# Altium schematic sheet MotorDriver.SchDoc
size A4
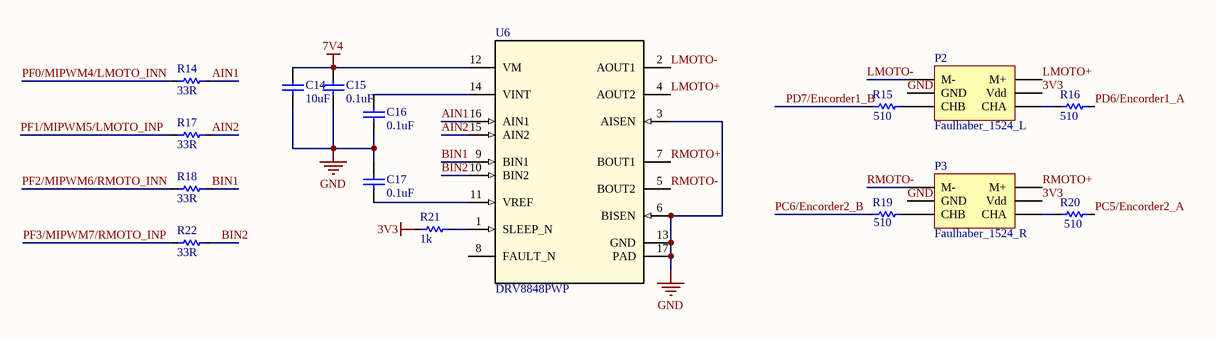
[diagram p0: MotorDriver.SchDoc]

## Parts
C14  value 10uF  [1206]  (hidden comment: 1uF/0603/50V)
C15  value 0.1uF  [0603C]  (hidden comment: 1uF/0603/50V)
C16  value 0.1uF  [0603C]  (hidden comment: 1uF/0603/50V)
C17  value 0.1uF  [0603C]  (hidden comment: 1uF/0603/50V)
P2  Faulhaber_1524_L  [HDR2X3_2.0Mm]
P3  Faulhaber_1524_R  [HDR2X3_2.0Mm]
R14  33R  [0603R]
R15  value 510  [0603R]  (hidden comment: 1K/5%)
R16  510  [0603R]
R17  33R  [0603R]
R18  33R  [0603R]
R19  value 510  [0603R]  (hidden comment: 1K/5%)
R20  value 510  [0603R]  (hidden comment: 1K/5%)
R21  1k  [0603R]
R22  33R  [0603R]
U6  DRV8848PWP  [HSSOP_N]

## Nets
3V3: P2.4(Vdd) P3.4(Vdd) R21.1
7V4: C14.1 C15.1 U6.12(VM)
GND: C14.2 C15.2 C16.2 C17.2 P2.3(GND) P3.3(GND) U6.3(AISEN) U6.6(BISEN) U6.13(GND) U6.17(PAD)
AIN1: R14.2 U6.16(AIN1)
AIN2: R17.2 U6.15(AIN2)
BIN1: R18.2 U6.9(BIN1)
BIN2: R22.2 U6.10(BIN2)
LMOTO+: P2.2(M+) U6.4(AOUT2)
LMOTO-: P2.1(M-) U6.2(AOUT1)
PC5/Encorder2_A: R20.2
PC6/Encorder2_B: R19.1
PD6/Encorder1_A: R16.2
PD7/Encorder1_B: R15.1
PF0/MIPWM4/LMOTO_INN: R14.1
PF1/MIPWM5/LMOTO_INP: R17.1
PF2/MIPWM6/RMOTO_INN: R18.1
PF3/MIPWM7/RMOTO_INP: R22.1
RMOTO+: P3.2(M+) U6.7(BOUT1)
RMOTO-: P3.1(M-) U6.5(BOUT2)
NetC16_1: C16.1 U6.14(VINT)
NetC17_1: C17.1 U6.11(VREF)
NetP2_5: P2.5(CHB) R15.2
NetP2_6: P2.6(CHA) R16.1
NetP3_5: P3.5(CHB) R19.2
NetP3_6: P3.6(CHA) R20.1
NetR21_2: R21.2 U6.1(SLEEP_N)

Not connected (* = marked no-connect by the designer): U6 8(FAULT_N)

## Library data of the parts
C14-C17 = Cap: Capacitor; Published: 8-Jun-2000; LatestRevisionDate: 17-Jul-2002; LatestRevisionNote: Re-released for DXP Platform.; PackageReference: RAD-0.3; Publisher: Altium Limited; PackageDescription: Radial Cap, Thru-Hole; 2 Leads; 0.3 in Pin Spacing
P2 P3 = Faulhaber_1524
R14 R16-R18 R22 = Res1: Resistor; Value: 1K; Published: 8-Jun-2000; LatestRevisionDate: 17-Jul-2002; LatestRevisionNote: Re-released for DXP Platform.; PackageReference: AXIAL-0.3; Publisher: Altium Limited; PackageDescription: Axial Device, Thru-Hole; 2 Leads; 0.3 in Pin Spacing
R15 R19-R21 = Res1: Resistor; Published: 8-Jun-2000; LatestRevisionDate: 17-Jul-2002; LatestRevisionNote: Re-released for DXP Platform.; PackageReference: AXIAL-0.3; Publisher: Altium Limited; PackageDescription: Axial Device, Thru-Hole; 2 Leads; 0.3 in Pin Spacing
  R21: Value: 1K
U6 = DRV8848PWP: Imported; PartNumber: DRV8848PWPR; Manufacturer: Texas Instruments; CompType: IC; PIN_COUNT: 17; Alternate_PartNumber: DRV8848PWP; PackageReference: PWP0016C; MountType: SMT; RoHS: Y; RefDes: RefDes; TYPE: TYPE; Value: Value